# EAGLE design delorean (EAGLE 9.6.2)
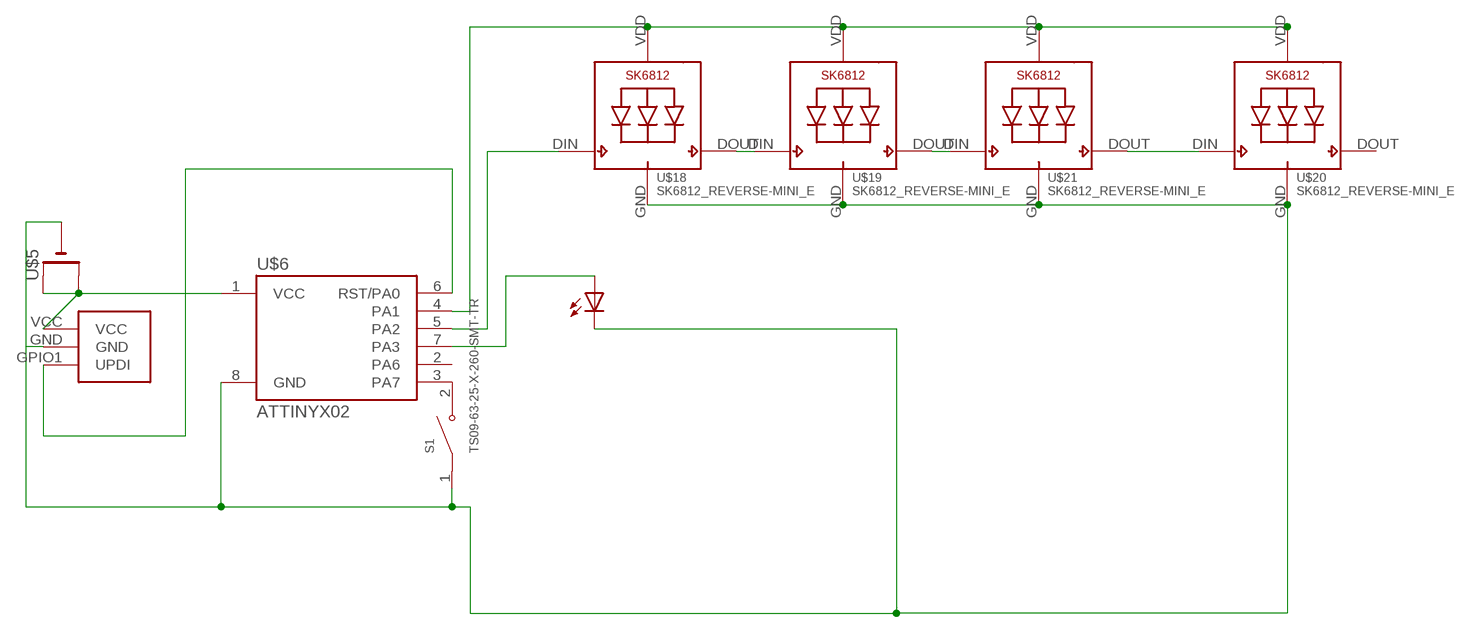
[diagram p0: schematic, sheet 1]

## Parts
S1  TS09-63-25-X-260-SMT-TR  [SW_TS09-63-25-X-260-SMT-TR]
U$1  LED_SMD_REVERSEMOUNT3528  [B/3528-21R]
U$5  CR2032SMT  [CR2032-SMD]
U$6  ATTINYX02  [SOIC08_JEDEC_150MIL]
U$7  SAO  [SAO_SMD]
U$18  SK6812_REVERSE-MINI_E  [SK6812-MINI-E]
U$19  SK6812_REVERSE-MINI_E  [SK6812-MINI-E]
U$20  SK6812_REVERSE-MINI_E  [SK6812-MINI-E]
U$21  SK6812_REVERSE-MINI_E  [SK6812-MINI-E]

## Nets
GND: S1.1 U$1.+(C) U$5.- U$6.8(GND) U$7.GND U$18.GND U$19.GND U$20.GND U$21.GND
LED: U$1.-(A) U$6.7(PA3)
N$2: U$6.6(RST/PA0) U$7.GPIO1(UPDI)
N$4: U$5.+$1(+) U$5.+$2(+1) U$6.1(VCC) U$7.VCC
N$6: S1.2 U$6.3(PA7)
N$7: U$18.DOUT(DO) U$19.DIN(DI)
N$8: U$6.4(PA1) U$18.VDD U$19.VDD U$20.VDD U$21.VDD
N$9: U$6.5(PA2) U$18.DIN(DI)
N$11: U$19.DOUT(DO) U$21.DIN(DI)
N$13: U$20.DIN(DI) U$21.DOUT(DO)
Unconnected: U$6.2(PA6) U$20.DOUT(DO)

## Library data of the parts
S1 = mylibrary:TS09-63-25-X-260-SMT-TR; MANUFACTURER: CUI Devices; MAXIMUM_PACKAGE_HEIGHT: 2.5 mm; PARTREV: 1.0; STANDARD: Manufacturer Recommendations
U$1 = mylibrary:LED_SMD_REVERSEMOUNT
U$5 = adafruit:CR2032
U$6 = mylibrary:ATTINYX02
U$7 = mylibrary:SAO
U$18-U$21 = mylibrary:SK6812_REVERSE-MINI_E

## Board
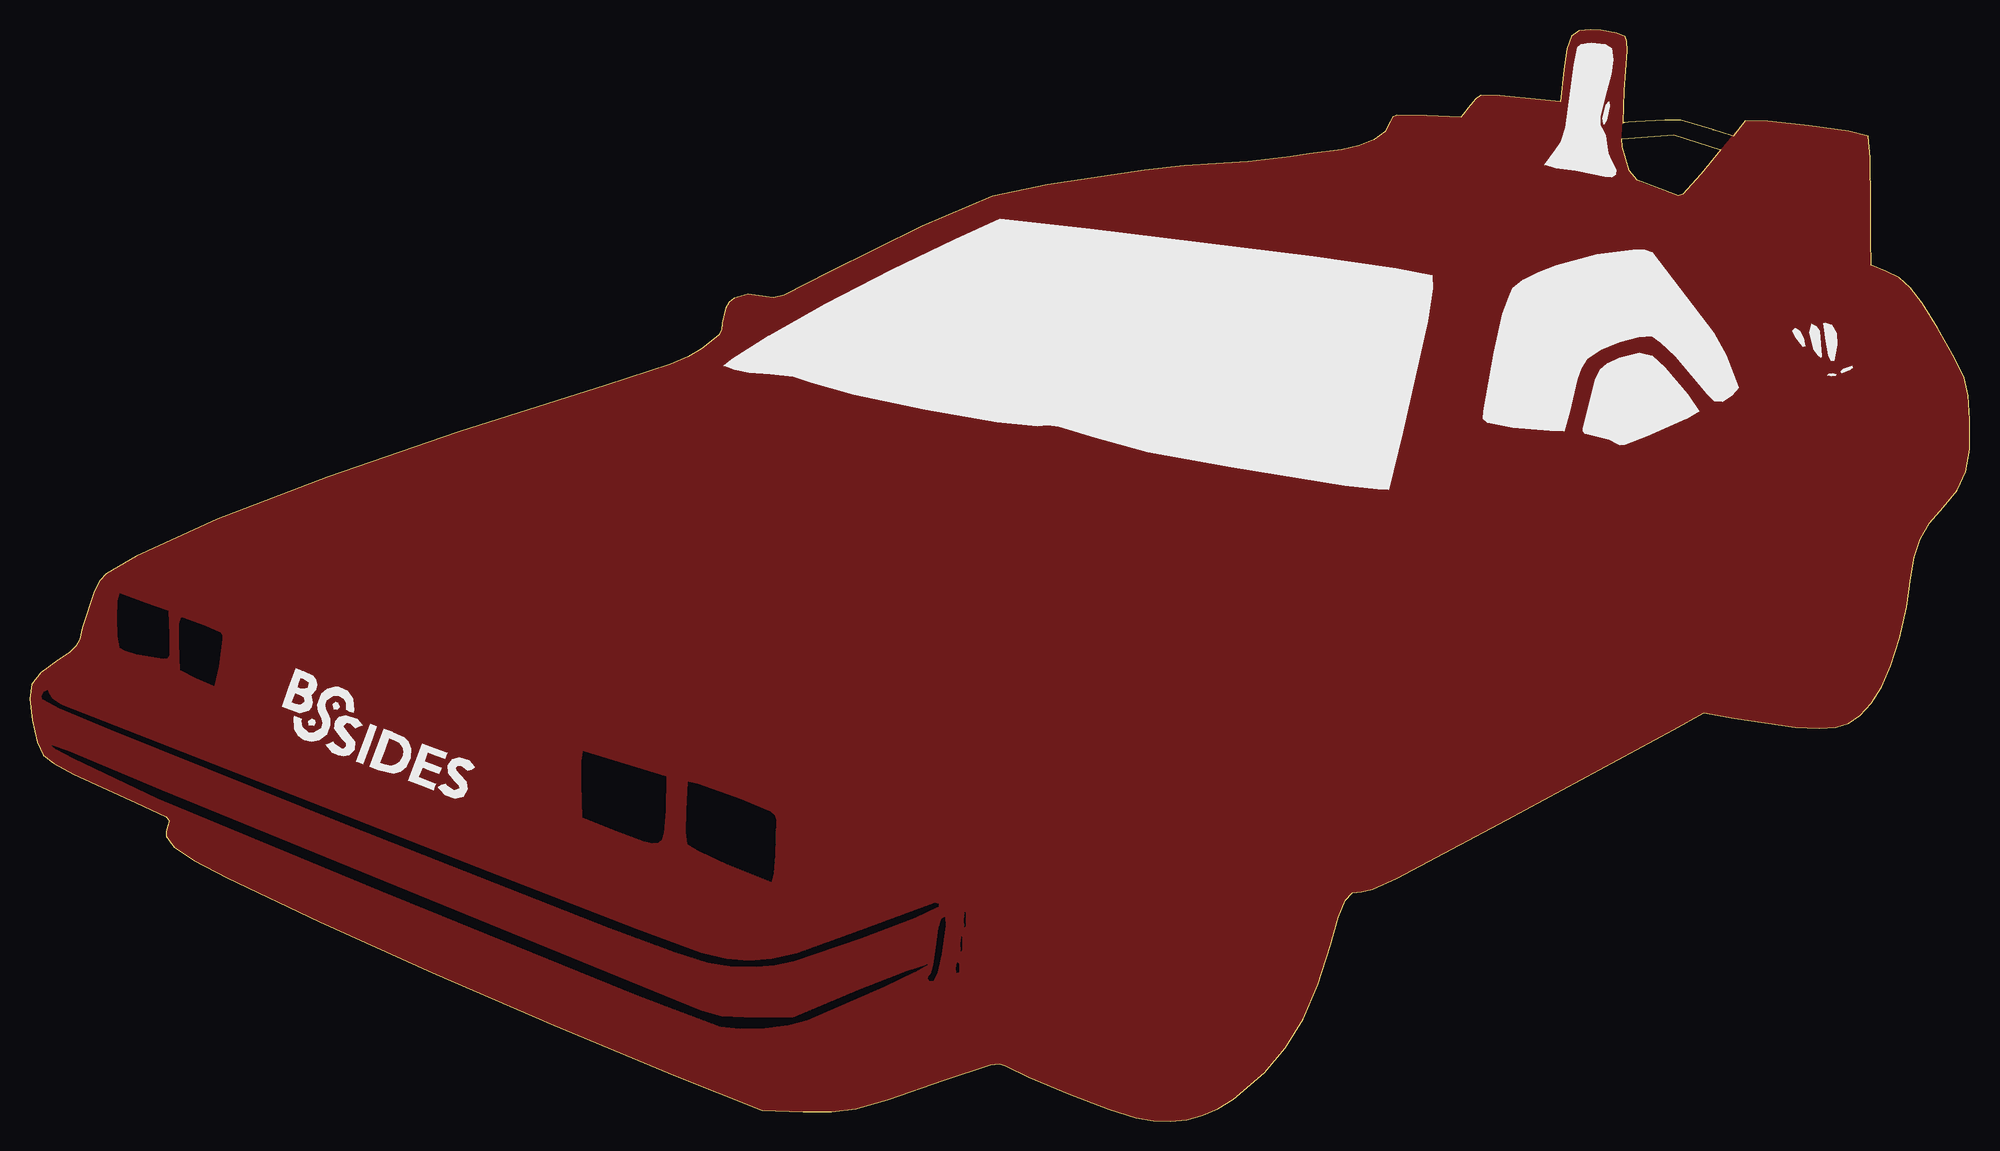
[diagram p1: board, top side]
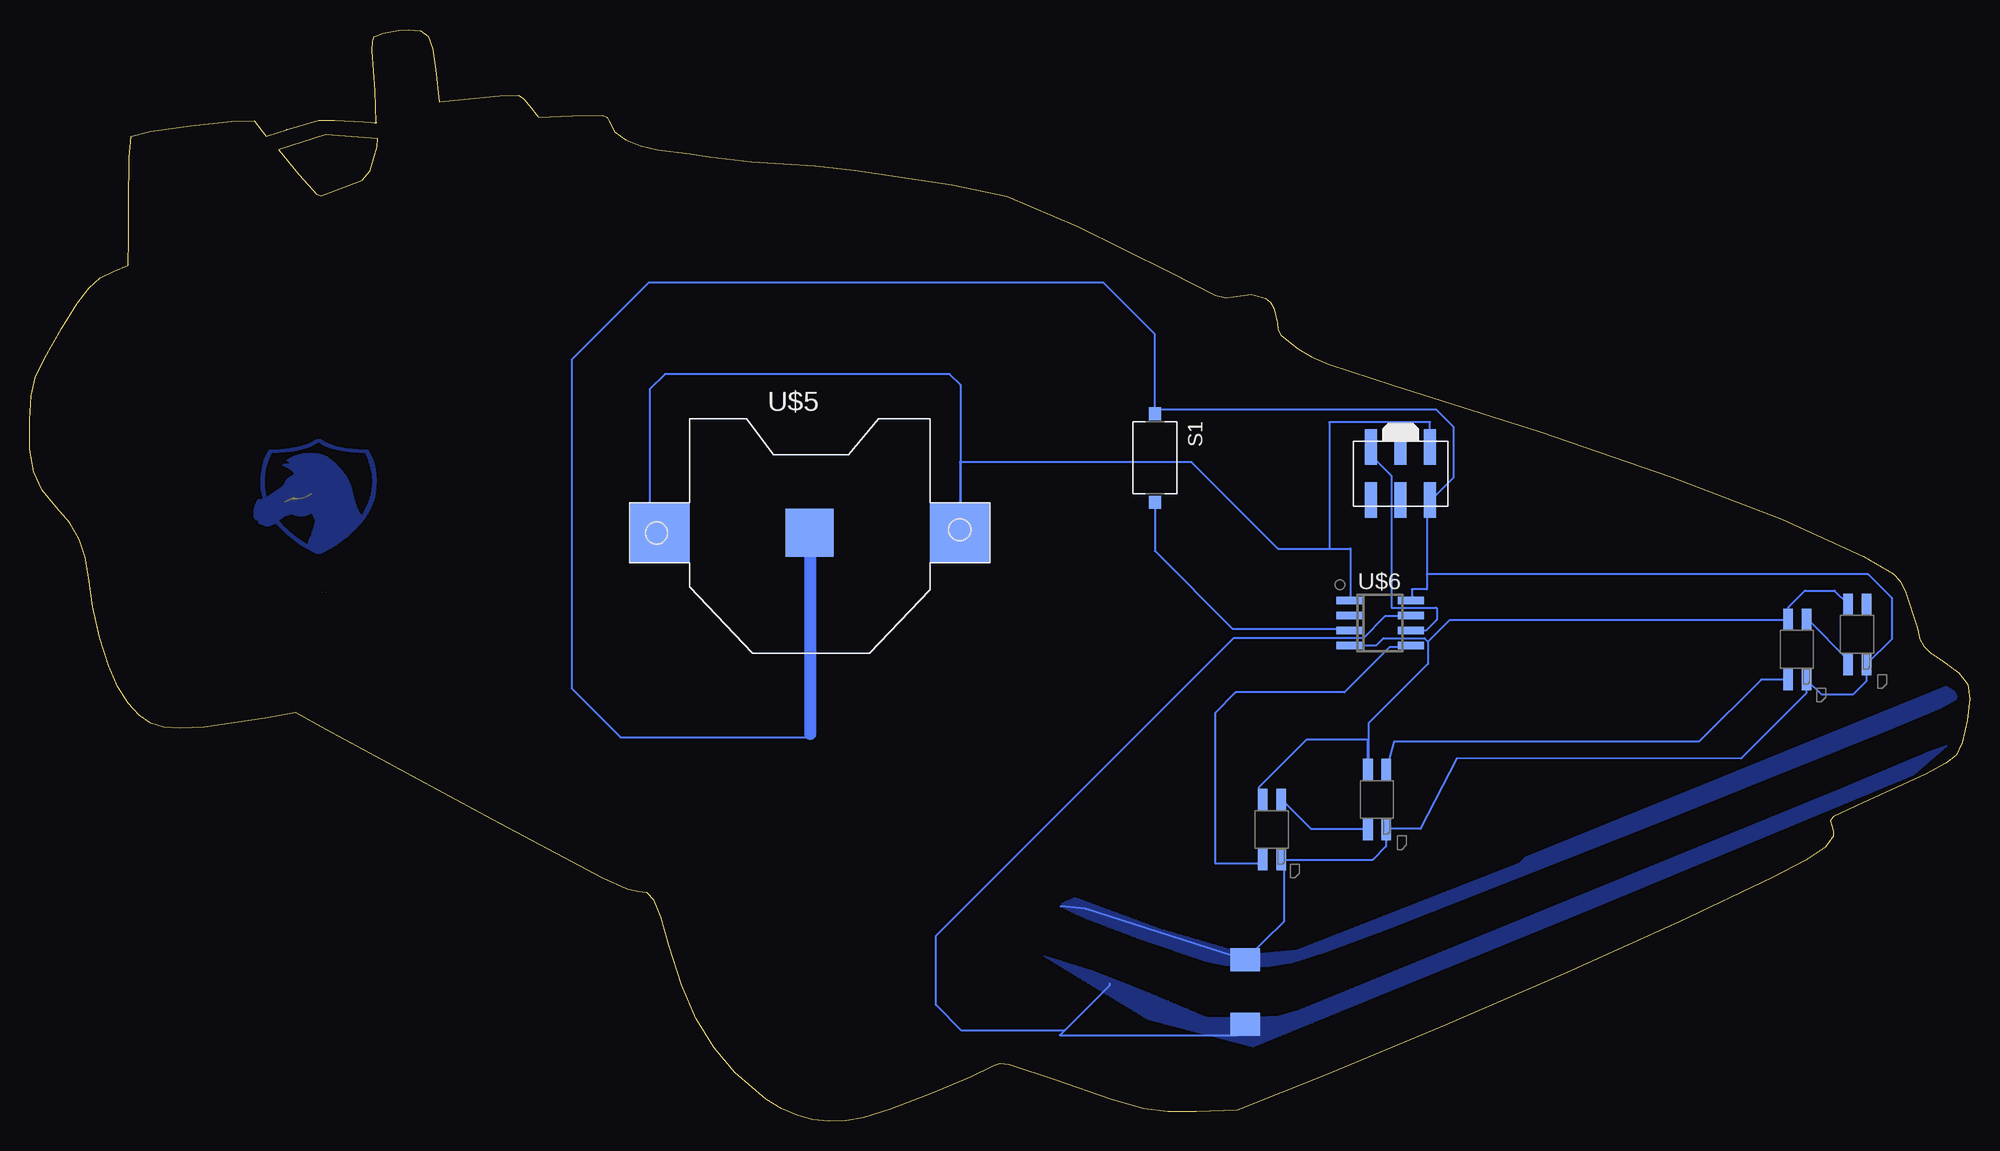
[diagram p2: board, bottom side, seen from below]

Size 164.2 x 92.37 mm. Coordinates in mm from the lower left corner, seen from the top.
Outline: 0.21,36.99 0,35.74 0.21,33.92 0.66,32.06 1.17,30.98 2.07,30.31 3.75,29.38 9.04,26.96 11.56,25.78 11.81,25.43 11.69,25.01 11.55,24.56 11.58,24.12 12.26,23.21 13.9,22.11 16.71,20.63 24.55,16.88 34.09,12.58 44.4,8.12 54.54,3.92 61.96,0.93 65.46,0.82 67.86,0.8 69.92,1.07 72.71,1.89 77.33,3.49 81.3,4.78 82.09,4.87 82.57,4.7 84.57,3.73 87.9,2.35 91.32,1.04 93.63,0.3 95.12,0.05 96.55,0 97.93,0.15 99.26,0.51 100.57,1.08 101.88,1.87 104.51,4.12 106.29,6.23 107.79,8.69 109.04,11.55 110.06,14.87 110.74,17.26 111.33,18.69 111.96,19.35 112.72,19.44 113.64,19.66 115.7,20.59 125.02,25.5 139.08,33.14 141.7,34.58 144.25,34.09 149.41,33.35 151.43,33.24 152.86,33.34 153.93,33.69 154.9,34.35 155.83,35.36 156.73,36.75 157.51,38.53 158.26,40.93 158.86,43.55 159.21,45.98 159.47,47.75 159.99,49.26 160.79,50.63 161.93,51.94 163.13,53.38 163.86,54.95 164.19,56.86 164.2,59.36 164.05,61.38 163.71,62.89 162.92,64.58 161.47,67.11 160.16,69.22 159.16,70.55 158.2,71.36 157.06,71.92 155.83,72.41 155.82,74.65 155.82,77.69 155.75,81.53 155.58,83.35 153.95,83.75 150.55,84.24 147.07,84.62 145.19,84.67 144.16,83.36 144.03,83.39 142.45,83.91 142.47,83.9 139.71,84.71 138.4,84.72 135.94,84.58 135.31,84.52 135,84.47 134.81,84.48 134.85,84.48 134.96,87.21 135.22,90.58 135.18,91.39 135.04,91.77 134.3,92.08 132.97,92.31 132.13,92.37 132.13,92.37 131.09,92.28 130.46,91.78 130.09,90.73 129.83,88.96 129.52,86.27 127.83,86.44 124.43,86.78 122.83,86.79 122.4,86.52 121.92,85.95 121.12,84.95 118.23,85.09 115.7,85.13 115.31,84.96 115.17,84.61 114.71,83.71 113.77,83.03 112.51,82.55 111.07,82.22 108.31,81.85 106.71,81.62 103.11,81.2 100.39,81.02 97.75,80.85 94.36,80.48 86.12,79.26 81.46,78.27 75.5,75.72 67.67,71.82 63.83,69.89 62.97,69.66 62.34,69.75 60.79,69.96 59.62,69.64 59.19,69.29 58.88,68.81 58.62,67.52 58.56,66.97 58.33,66.51 56.88,65.36 55.74,64.69 54.24,64.04 48.8,62.28 36.35,58.36 25.18,54.51 15.88,50.92 9.03,47.82 6.47,46.35 5.93,45.73 5.49,44.87 4.47,41.75 4.23,40.81 3.92,40.19 3.36,39.66 2.39,39.01 0.96,37.98 0.21,36.99
Outline: 134.72,83.14 139.12,83.47 143.1,82.22 141.43,80.15 141.38,80.09 139.88,78.46 139.52,78.31 136.04,79.61 135.37,80.41 134.77,82.45 134.72,83.14
Copper layers (1*16): Top 0.035mm / dielectric 1.5mm / Bottom 0.035mm
Design rules "default *": minimum track width 6mil, minimum drill 0.35mm, track to track 6mil, track to pad 6mil, pad to pad 6mil, via to via 6mil, smd to smd 6mil, copper to edge 0mil, drill to drill 6mil, minimum pad ring 10mil, minimum via ring 8mil, stop-mask expansion 4mil, vias tented up to drill 0mil, thermal gap 10mil
tRestrict: area 7.4,39.2 to 11.8,44.6; area 12.7,36.9 to 16.3,42.6; area 46.7,23.5 to 53.8,31.3; area 55.6,20.3 to 63.1,28.7; area 1.9,7.8 to 75.9,31.8; area 1.1,13.1 to 76.9,36.5; area 76.1,11.9 to 77.5,17.3; area 79.1,16.5 to 79.2,17.7; area 78.5,12.6 to 78.6,13.4; area 78.8,14.4 to 78.9,15.6
bRestrict: area 135.2,51.4 to 144.3,57.4; area 140.1,48.9 to 143,51.4

### Footprints (pad centres in the part's own frame; a part is rotated, then mirrored left to right if it is on the bottom)
SW_TS09-63-25-X-260-SMT-TR = smd 1.1 x 1: 1 -3.75,0; 2 3.75,0
B/3528-21R = smd 1.95 x 2.5: + 1.525,0; - -3.925,0
CR2032-SMD = smd 5.08 x 5.08: +$1 -12.7,0; +$2 12.7,0 | smd 4.064 x 4.064: - 0,0
SOIC08_JEDEC_150MIL = smd 0.6 x 2.2: 1 -1.905,-2.6; 2 -0.635,-2.6; 3 0.635,-2.6; 4 1.905,-2.6; 5 1.905,2.6; 6 0.635,2.6; 7 -0.635,2.6; 8 -1.905,2.6
SAO_SMD = smd 1 x 3: GND 5.5,1.5; GPIO1 0.5,6; GPIO2 0.5,1.5; SCL 3,1.5; SDA 3,6; VCC 5.5,6
SK6812-MINI-E = smd 0.82 x 1.8: DIN 2.3,6.05; DOUT 0.75,0.95; GND 0.75,6.05; VDD 2.3,0.95

### Placement (x,y rotation side)
S1  68.97,56.14 270 bottom
U$1  61.35,12.14 90 bottom
U$5  98.18,49.79 0 bottom
U$6  49.92,42.17 270 bottom
U$7  51.19,51.06 0 bottom
U$18  57.54,28.2 180 bottom
U$19  48.65,30.74 180 bottom
U$20  8.01,44.71 180 bottom
U$21  13.09,43.44 180 bottom

### Tracks (layer width: path | path; a pad name or v marks a point on that pad's centre or on a via)
GND
  Bottom 0.152: 98.13,49.73 U$5.- | 76.94,18.19 74.83,17.98 U$1.+ 58.07,16.91 58.07,21.93 U$18.GND 58.2,22.15 50.53,22.15 49.42,23.26 49.42,24.66 U$19.GND 49.36,24.74 46.49,24.74 43.43,30.71 19.38,30.69 13.84,36.23 U$21.GND 12.57,36.12 9.89,36.12 8.76,37.25 U$20.GND 6.63,40.79 6.63,44.29 8.62,46.28 45.96,46.28 | 45.96,46.28 45.96,51.92 45.7,52.17 45.7,52.48 U$7.GND 45.55,52.63 43.67,54.51 43.67,58.73 45.19,60.24 68.61,60.24 S1.1 68.97,66.61 73.3,70.95 111.83,70.95 118.33,64.45 118.33,36.63 114.2,32.5 98.4,32.5 98.13,32.77 | 45.96,46.28 45.96,45.01 47.23,45.01 47.23,44.1 U$6.8
  Bottom 1.016: 98.13,32.77 98.13,49.73
  pour Bottom (no thermals): 1.1,35.73 1.07,36.03 1.25,36.34 2.03,36.81 37.62,22.34 38.13,21.82 56.97,14.48 61.16,14.1 68.2,16.15 68.3,16.15 75.72,18.92 76.86,18.4 76.88,18.14 74.92,17.21 70.38,15.48 64.64,13.55 63.04,13.21 61.53,13.09 59.28,13.13 57.42,13.4 54.61,14.31 49.11,16.36 27.19,24.96 6.85,33.12 2.52,34.96
LED
  Bottom 0.152: 76.59,7.72 85.38,7.72 87.51,9.86 87.51,15.7 62.31,40.9 51.34,40.9 49.51,42.72 47.38,42.72 U$6.7 | U$1.- 61.35,7.92 61.98,7.29 77.02,7.29 76.59,7.72 | 76.59,7.72 72.78,11.53 72.78,11.69
  pour Bottom (no thermals): 4.75,29.33 1.94,31.77 1.99,31.79 1.99,31.79 3.22,31.36 11.18,28.01 56.73,9.39 58.53,8.91 61.38,8.79 64.58,8.78 70.19,11.13 74.19,12.72 78.4,14.01 69.55,8.65 60.69,6.33 30.79,18.5 30.74,18.55
N$2
  Bottom 0.152: U$7.GPIO1 50.69,56.37 48.94,54.62 48.94,43.46 45.19,43.46 45.12,43.4 45.12,42.46 46.05,41.53 U$6.6
N$4
  Bottom 0.152: U$6.1 52.41,44.1 52.41,48.49 52.43,48.46 54.22,48.46 | U$7.VCC 45.69,59.15 54.19,59.15 54.22,59.13 54.22,48.46 | U$5.+$1 111.72,50.63 111.72,61.93 110.43,63.22 86.34,63.22 85.43,62.32 85.43,49.83 U$5.+$2 85.48,55.78 65.87,55.78 58.55,48.46 54.22,48.46
N$6
  Bottom 0.152: S1.2 68.97,48.26 62.36,41.66 52.56,41.66 U$6.3
N$7
  Bottom 0.152: U$19.DIN 51.04,24.74 55.76,24.74 58.2,27.18 U$18.DOUT
N$8
  Bottom 0.152: U$20.VDD 11.46,44.91 13.97,44.91 15.39,43.49 U$21.VDD 15.53,42.42 44.03,42.42 45.85,40.59 | 45.85,40.59 45.85,38.71 50.88,33.68 50.88,29.92 U$19.VDD 50.95,32.33 56.11,32.33 60.2,28.24 60.2,27.6 U$18.VDD | 45.85,40.59 46.16,40.9 49.61,40.9 50.22,40.29 52.41,40.29 U$6.4 52.56,40.13
N$9
  Bottom 0.152: U$6.5 47.38,40.13 49.11,40.13 52.94,36.3 62.14,36.3 63.89,34.55 63.89,21.85 60.14,21.85 U$18.DIN
N$11
  Bottom 0.152: U$21.DIN 17.68,37.39 22.93,32.13 48.74,32.13 U$19.DOUT
N$13
  Bottom 0.152: U$20.DIN 10.35,38.76 10.35,39.07 13.7,42.42 U$21.DOUT
N$15
  pour Bottom: 134.9,54.74 134.89,54.2 134.89,53.64 134.94,53.24 135.01,52.86 135.12,52.48 135.25,52.11 135.42,51.75 135.62,51.39 135.85,51.04 136.11,50.69 136.37,50.4 136.68,50.07 137.01,49.76 137.33,49.47 137.79,49.11 138.31,48.75 138.86,48.4 139.44,48.08 139.56,48.02 139.74,48.02 139.92,48.02 140.04,48.09 140.04,48.09 140.72,48.47 141.32,48.85 141.85,49.24 142.35,49.65 142.81,50.09 143.22,50.52 143.31,50.62 143.4,50.57 143.6,50.46 143.79,50.38 143.95,50.33 144.08,50.32 144.34,50.39 144.63,50.5 144.76,50.58 144.82,50.65 144.82,50.72 144.81,50.79 144.81,50.8 144.84,50.81 144.97,50.85 145.07,50.93 145.13,51.02 145.18,51.15 145.2,51.24 145.2,51.38 145.18,51.63 145.12,51.92 145.01,52.28 144.89,52.56 144.85,52.62 144.78,52.64 144.69,52.64 144.62,52.6 144.58,52.56 144.42,52.66 144.45,52.78 144.52,53.14 144.57,53.52 144.59,54.04 144.59,54.58 144.53,55.09 144.43,55.57 144.28,56.03 144.1,56.47 144.01,56.64 143.93,56.72 143.84,56.81 143.67,56.82 142.93,56.86 142.19,56.95 141.49,57.07 140.87,57.24 140.6,57.34 140.36,57.44 140.15,57.55 139.98,57.67 139.9,57.72 139.57,57.72 139.53,57.69 139.4,57.6 139.23,57.5 138.93,57.36 138.6,57.24 138.23,57.13 137.82,57.04 137.38,56.96 136.91,56.9 136.41,56.85 135.88,56.82 135.64,56.81 135.55,56.72 135.44,56.59 135.32,56.36 135.17,55.98 135.05,55.59 134.96,55.17
S$1
  pour Top: 0.21,36.99 0,35.74 0.21,33.92 0.66,32.06 1.17,30.98 2.07,30.31 3.75,29.38 9.04,26.96 11.56,25.78 11.81,25.43 11.69,25.01 11.55,24.56 11.58,24.12 12.26,23.21 13.9,22.11 16.71,20.63 24.55,16.88 34.09,12.58 44.39,8.12 54.54,3.92 61.96,0.93 65.46,0.82 67.86,0.8 69.92,1.07 72.71,1.89 77.33,3.49 81.3,4.78 82.09,4.87 82.57,4.7 84.57,3.73 87.9,2.35 91.32,1.04 93.63,0.3 95.12,0.05 96.55,0 97.93,0.15 99.26,0.51 100.57,1.08 101.88,1.87 104.51,4.12 106.29,6.23 107.79,8.69 109.04,11.55 110.06,14.87 110.74,17.26 111.33,18.69 111.96,19.35 112.72,19.44 113.64,19.66 115.7,20.59 125.02,25.5 139.08,33.14 141.7,34.58 144.25,34.09 149.41,33.35 151.43,33.24 152.86,33.34 153.93,33.69 154.9,34.35 155.83,35.36 156.73,36.75 157.51,38.53 158.26,40.93 158.86,43.55 159.21,45.98 159.47,47.75 159.99,49.26 160.79,50.63 161.93,51.94 163.13,53.38 163.86,54.95 164.19,56.86 164.2,59.36 164.05,61.38 163.71,62.89 162.92,64.58 161.47,67.11 160.16,69.22 159.16,70.55 158.2,71.36 157.06,71.92 155.83,72.41 155.82,74.65 155.82,77.69 155.75,81.53 155.58,83.35 153.95,83.75 150.55,84.24 147.07,84.62 145.19,84.67 142.44,81.34 140.48,78.93 139.89,78.4 139.54,78.27 137.34,79.04 136.33,79.42 135.75,79.79 135.4,80.36 135.07,81.34 134.79,82.37 134.68,83.39 134.96,87.21 135.22,90.58 135.18,91.39 135.04,91.77 134.3,92.08 132.97,92.31 132.13,92.37 132.13,92.37 131.09,92.28 130.46,91.78 130.09,90.73 129.83,88.96 129.52,86.27 127.83,86.44 124.42,86.78 122.83,86.79 122.4,86.52 121.92,85.95 121.12,84.95 118.23,85.09 115.7,85.13 115.31,84.96 115.17,84.61 114.71,83.71 113.77,83.03 112.51,82.55 111.07,82.22 108.31,81.85 106.71,81.62 103.11,81.2 100.39,81.02 97.75,80.85 94.36,80.48 86.12,79.26 81.46,78.27 75.5,75.72 67.67,71.82 63.83,69.89 62.97,69.66 62.34,69.75 60.79,69.96 59.62,69.64 59.19,69.29 58.88,68.81 58.62,67.52 58.56,66.97 58.33,66.51 56.88,65.36 55.74,64.69 54.24,64.04 48.8,62.28 36.35,58.36 25.18,54.51 15.88,50.92 9.03,47.82 6.47,46.35 5.93,45.73 5.49,44.87 4.47,41.75 4.23,40.81 3.92,40.19 3.36,39.66 2.39,39.01 0.96,37.98

### Text on the board
bDocu: BSIDES CHELTENHAM 2023 | 3v3 | UPDI | Badges by: | GND | DevSecOps